# Altium schematic sheet Root.SchDoc
size A4; SheetNumber: 1; SheetTotal: 10
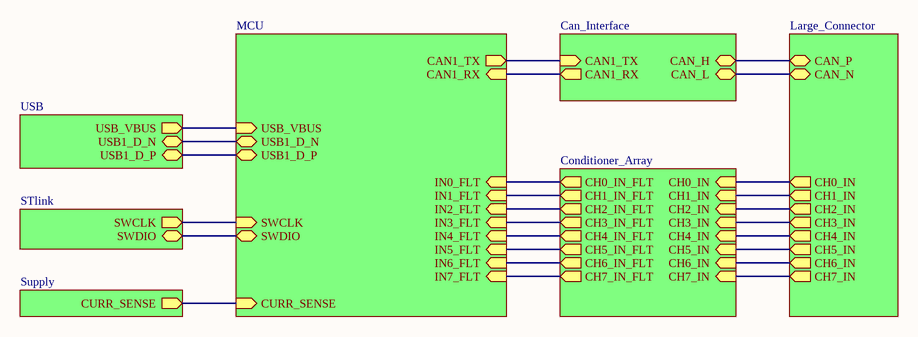
[diagram p0: Root.SchDoc]

## Sub-sheets
Can_Interface = Can_Interface: CAN_H (bidir), CAN_L (bidir), CAN1_TX (in), CAN1_RX (out)
Conditioner_Array = Conditioner_Array: CH1_IN (in), CH2_IN (in), CH3_IN (in), CH4_IN (in), CH5_IN (in), CH6_IN (in), CH7_IN (in), CH0_IN (in), CH0_IN_FLT (out), CH1_IN_FLT (out), CH2_IN_FLT (out), CH3_IN_FLT (out), CH4_IN_FLT (out), CH5_IN_FLT (out), CH7_IN_FLT (out), CH6_IN_FLT (out)
Large Connector = Large_Connector: CAN_P (bidir), CAN_N (bidir), CH1_IN (out), CH2_IN (out), CH3_IN (out), CH4_IN (out), CH5_IN (out), CH6_IN (out), CH7_IN (out), CH0_IN (out)
MCU = MCU: IN1_FLT (in), IN2_FLT (in), IN3_FLT (in), IN4_FLT (in), IN5_FLT (in), IN6_FLT (in), IN7_FLT (in), IN0_FLT (in), CURR_SENSE (in), SWCLK (in), SWDIO (bidir), USB1_D_N (bidir), USB1_D_P (bidir), USB_VBUS (in), CAN1_TX (out), CAN1_RX (in)
STlink = STlink: SWDIO (bidir), SWCLK (out)
Supply = Supply: CURR_SENSE (out)
USB = USB: USB1_D_P (bidir), USB1_D_N (bidir), USB_VBUS (out)

## Nets
(unnamed): sheet MCU/IN1_FLT, sheet Conditioner_Array/CH1_IN_FLT
(unnamed): sheet MCU/IN2_FLT, sheet Conditioner_Array/CH2_IN_FLT
(unnamed): sheet MCU/IN3_FLT, sheet Conditioner_Array/CH3_IN_FLT
(unnamed): sheet MCU/IN4_FLT, sheet Conditioner_Array/CH4_IN_FLT
(unnamed): sheet MCU/IN5_FLT, sheet Conditioner_Array/CH5_IN_FLT
(unnamed): sheet MCU/IN6_FLT, sheet Conditioner_Array/CH6_IN_FLT
(unnamed): sheet MCU/IN7_FLT, sheet Conditioner_Array/CH7_IN_FLT
(unnamed): sheet MCU/IN0_FLT, sheet Conditioner_Array/CH0_IN_FLT
(unnamed): sheet MCU/CURR_SENSE, sheet Supply/CURR_SENSE
(unnamed): sheet MCU/SWCLK, sheet STlink/SWCLK
(unnamed): sheet MCU/SWDIO, sheet STlink/SWDIO
(unnamed): sheet MCU/USB1_D_N, sheet USB/USB1_D_N
(unnamed): sheet MCU/USB1_D_P, sheet USB/USB1_D_P
(unnamed): sheet MCU/USB_VBUS, sheet USB/USB_VBUS
(unnamed): sheet MCU/CAN1_TX, sheet Can_Interface/CAN1_TX
(unnamed): sheet MCU/CAN1_RX, sheet Can_Interface/CAN1_RX
(unnamed): sheet Conditioner_Array/CH1_IN, sheet Large Connector/CH1_IN
(unnamed): sheet Conditioner_Array/CH2_IN, sheet Large Connector/CH2_IN
(unnamed): sheet Conditioner_Array/CH3_IN, sheet Large Connector/CH3_IN
(unnamed): sheet Conditioner_Array/CH4_IN, sheet Large Connector/CH4_IN
(unnamed): sheet Conditioner_Array/CH5_IN, sheet Large Connector/CH5_IN
(unnamed): sheet Conditioner_Array/CH6_IN, sheet Large Connector/CH6_IN
(unnamed): sheet Conditioner_Array/CH7_IN, sheet Large Connector/CH7_IN
(unnamed): sheet Conditioner_Array/CH0_IN, sheet Large Connector/CH0_IN
(unnamed): sheet Large Connector/CAN_P, sheet Can_Interface/CAN_H
(unnamed): sheet Large Connector/CAN_N, sheet Can_Interface/CAN_L